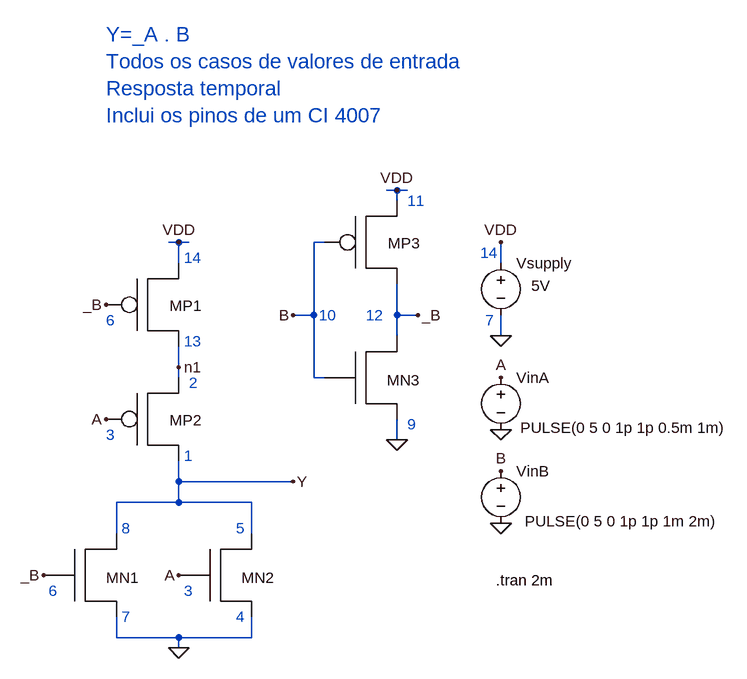
[diagram p0: schematic static-gate-tran.asc]
static-gate-tran.asc, the LTspice schematic file:
Version 4
SHEET 1 2472 680
WIRE 544 -96 528 -96
WIRE 560 -96 544 -96
WIRE 544 -80 544 -96
WIRE 208 -16 192 -16
WIRE 224 -16 208 -16
WIRE 432 -16 416 -16
WIRE 208 16 208 -16
WIRE 704 16 704 -16
WIRE 416 96 416 -16
WIRE 416 96 384 96
WIRE 544 96 544 48
WIRE 576 96 544 96
WIRE 544 128 544 96
WIRE 704 128 704 96
WIRE 208 176 208 144
WIRE 208 192 208 176
WIRE 416 192 416 96
WIRE 432 192 416 192
WIRE 544 288 544 256
WIRE 208 352 208 320
WIRE 384 352 208 352
WIRE 208 384 208 352
WIRE 208 384 112 384
WIRE 320 384 208 384
WIRE 112 432 112 384
WIRE 320 432 320 384
WIRE 112 592 112 560
WIRE 208 592 112 592
WIRE 320 592 320 560
WIRE 320 592 208 592
WIRE 208 608 208 592
FLAG 704 128 0
FLAG 704 272 0
FLAG 704 416 0
FLAG 704 -16 VDD
FLAG 704 192 A
FLAG 704 336 B
FLAG 544 -96 VDD
FLAG 384 96 B
FLAG 576 96 _B
FLAG 208 -16 VDD
FLAG 96 80 _B
FLAG 0 496 _B
FLAG 96 256 A
FLAG 208 496 A
FLAG 384 352 Y
FLAG 208 176 n1
FLAG 544 288 0
FLAG 208 608 0
SYMBOL voltage 704 0 R0
WINDOW 3 47 51 Left 2
SYMATTR Value 5V
SYMATTR InstName Vsupply
SYMBOL voltage 704 176 R0
WINDOW 123 0 0 Left 2
WINDOW 39 0 0 Left 2
WINDOW 3 30 93 Left 2
SYMATTR InstName VinA
SYMATTR Value PULSE(0 5 0 1p 1p 0.5m 1m)
SYMBOL voltage 704 320 R0
WINDOW 123 0 0 Left 2
WINDOW 39 0 0 Left 2
WINDOW 3 37 93 Left 2
SYMATTR InstName VinB
SYMATTR Value PULSE(0 5 0 1p 1p 1m 2m)
SYMBOL PMOSX 176 64 R0
SYMATTR InstName MP1
SYMBOL PMOSX 176 240 R0
SYMATTR InstName MP2
SYMBOL PMOSX 512 -32 R0
SYMATTR InstName MP3
SYMBOL NMOSX 80 480 R0
SYMATTR InstName MN1
SYMBOL NMOSX 288 480 R0
SYMATTR InstName MN2
SYMBOL NMOSX 512 176 R0
SYMATTR InstName MN3
TEXT 696 504 Left 2 !.tran 2m
TEXT 672 0 Left 2 ;14
TEXT 680 104 Left 2 ;7
TEXT 96 -336 Left 3 ;Y=_A . B\nTodos os casos de valores de entrada\nResposta temporal\nInclui os pinos de um CI 4007
TEXT 96 104 Left 2 ;6
TEXT 8 520 Left 2 ;6
TEXT 96 280 Left 2 ;3
TEXT 216 520 Left 2 ;3
TEXT 216 8 Left 2 ;14
TEXT 216 136 Left 2 ;13
TEXT 120 424 Left 2 ;8
TEXT 120 560 Left 2 ;7
TEXT 296 424 Left 2 ;5
TEXT 296 560 Left 2 ;4
TEXT 224 200 Left 2 ;2
TEXT 216 312 Left 2 ;1
TEXT 424 96 Left 2 ;10
TEXT 560 -80 Left 2 ;11
TEXT 496 96 Left 2 ;12
TEXT 560 264 Left 2 ;9

The netlist it stands for:
* static-gate-tran.asc
Vsupply VDD 0 5V
VinA A 0 PULSE(0 5 0 1p 1p 0.5m 1m)
VinB B 0 PULSE(0 5 0 1p 1p 1m 2m)
XMP1 n1 _B VDD PMOSX  ; pins D G S
XMP2 Y A n1 PMOSX  ; pins D G S
XMP3 _B B VDD PMOSX  ; pins D G S
XMN1 Y _B 0 NMOSX  ; pins D G S
XMN2 Y A 0 NMOSX  ; pins D G S
XMN3 _B B 0 NMOSX  ; pins D G S
.tran 2m
* 14
* 7
* Y=_A . B
* Todos os casos de valores de entrada
* Resposta temporal
* Inclui os pinos de um CI 4007
* 6
* 6
* 3
* 3
* 14
* 13
* 8
* 7
* 5
* 4
* 2
* 1
* 10
* 11
* 12
* 9
.lib MOS4007.txt
.backanno
.end